# Altium schematic sheet 08.SchDoc
size 297 x 209 mm
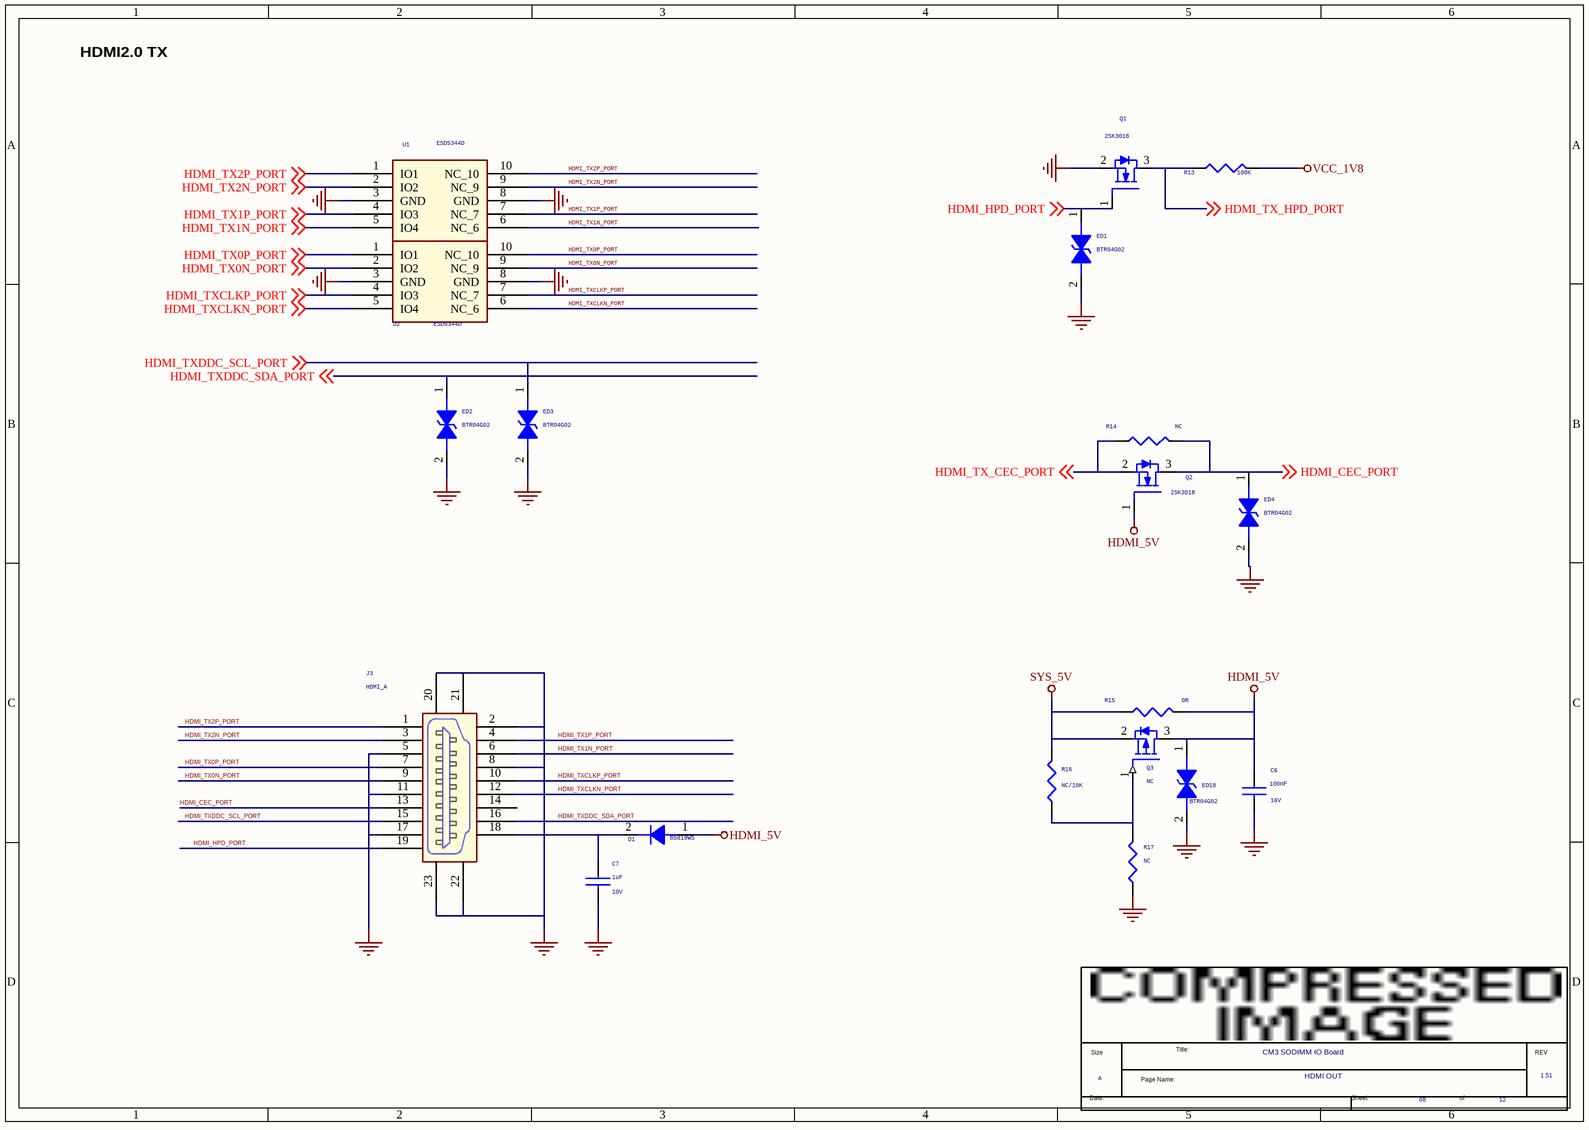
[diagram p0: 08.SchDoc]

## Parts
*  Page Count: 12  Page Number: 08  Page Size: A  Title: CM3 SODIMM IO Board  RevCode: 1.51  Doc: HDMI OUT  (hidden comment: radxa_1010)  (graphical)
C6  100nF  Voltage: 16V  [C0402]
C7  1uF  Voltage: 10V  [C0402]
D1  B5819WS  [SOD_323]
ED1  BTR04G02  [ESD0402_1xD5]
ED2  BTR04G02  [ESD0402_1xD5]
ED3  BTR04G02  [ESD0402_1xD5]
ED4  BTR04G02  [ESD0402_1xD5]
ED18  BTR04G02  [ESD0402_1xD5]
J3  HDMI_A  [HDMIA19S]
Q1  2SK3018  [SOT23]
Q2  2SK3018  [SOT23]
Q3  NC  [SOT23]
R13  100K  [R0402]
R14  NC  [R0402]
R15  0R  [R0402]
R16  NC/10K  [R0402]
R17  NC  [R0402]
U1  ESD5344D  [SON10_2R50X1R00X0R50]
U2  ESD5344D  [SON10_2R50X1R00X0R50]

## Nets
GND: C6.2 C7.2 ED1.2 ED2.2 ED3.2 ED4.2 ED18.2 J3.2 J3.5 J3.8 J3.11 J3.17 J3.20 J3.21 J3.22 J3.23 Q1.2(SOURCE) R17.1 U1.3(GND) U1.8(GND) U2.3(GND) U2.8(GND)
HDMI_5V: C6.1 D1.1(A) ED18.1 Q2.1(GATE) Q3.3(DRAIN) R15.2
SYS_5V: Q3.2(SOURCE) R15.1 R16.2
VCC_1V8: R13.2
HDMI_CEC_PORT: ED4.1 J3.13 Q2.3(DRAIN) R14.2 ; off-sheet HDMI_CEC_PORT
HDMI_HPD_PORT: ED1.1 J3.19 Q1.1(GATE) ; off-sheet HDMI_HPD_PORT
HDMI_TX0N_PORT: J3.9 U2.2(IO2) U2.9(NC_9) ; off-sheet HDMI_TX0N_PORT
HDMI_TX0P_PORT: J3.7 U2.1(IO1) U2.10(NC_10) ; off-sheet HDMI_TX0P_PORT
HDMI_TX1N_PORT: J3.6 U1.5(IO4) U1.6(NC_6) ; off-sheet HDMI_TX1N_PORT
HDMI_TX1P_PORT: J3.4 U1.4(IO3) U1.7(NC_7) ; off-sheet HDMI_TX1P_PORT
HDMI_TX2N_PORT: J3.3 U1.2(IO2) U1.9(NC_9) ; off-sheet HDMI_TX2N_PORT
HDMI_TX2P_PORT: J3.1($PIN0) U1.1(IO1) U1.10(NC_10) ; off-sheet HDMI_TX2P_PORT
HDMI_TX_CEC_PORT: Q2.2(SOURCE) R14.1 ; off-sheet HDMI_TX_CEC_PORT
HDMI_TX_HPD_PORT: Q1.3(DRAIN) R13.1 ; off-sheet HDMI_TX_HPD_PORT
HDMI_TXCLKN_PORT: J3.12 U2.5(IO4) U2.6(NC_6) ; off-sheet HDMI_TXCLKN_PORT
HDMI_TXCLKP_PORT: J3.10 U2.4(IO3) U2.7(NC_7) ; off-sheet HDMI_TXCLKP_PORT
HDMI_TXDDC_SCL_PORT: ED3.1 J3.15 ; off-sheet HDMI_TXDDC_SCL_PORT
HDMI_TXDDC_SDA_PORT: ED2.1 J3.16 ; off-sheet HDMI_TXDDC_SDA_PORT
NetC7_1: C7.1 D1.2(K) J3.18
NetQ3_1: Q3.1(GATE) R16.1 R17.2

Not connected (* = marked no-connect by the designer): J3 14

## Notes on the sheet
- HDMI2.0 TX
- (in symbol radxa_1010) Title:; Size; REV; Page Name:; Date:; Sheet; of

## Library data of the parts
C6 = CAP NP_0: cap,100.00nF,+/-10%,10V,X5R,C0201; Manufacturer PN: C0603X5R1A104K030BC; Manufacturer: TDK; Tolerance: 10%; Priority: A; Dielectric: X5R; Created by: JJJ; Part Type: C0201; RK PN: C0603X5R1A104K030BC
C7 = CAP NP_0: cap,1.00uF,+/-10%,10V,X5R,C0402; Manufacturer: TDK; RK PN: C1005X5R1A105K050BB; Priority: A; Tolerance: 10%; Dielectric: X5R; Part Type: C0402; Manufacturer PN: C1005X5R1A105K050BB; Created by: JJJ
D1 = DIODE_Dup1: Schottky Barrier，B5819WS SOD-323; Manufacturer: 长电; Priority: A; RK PN: B5819WS; Part Type: Schottky rectifier; Manufacturer PN: B5819WS; Created by: JJJ
ED1-ED4 = DIODE BI_DIR TRIG: 1-Line, Bi-directional, Transient Voltage Suppressors.17.5pF.; Manufacturer: WillSemi(韦尔半导体); RK PN: ESD5451N; Priority: A; Part Type: ESD_TVS; Manufacturer PN: ESD5451N; Created by: JJJ
ED18 = DIODE BI_DIR TRIG: 1-Line, Bi-directional, Transient Voltage Suppressors.17.5pF.; Manufacturer PN: ESD5451N; Manufacturer: WillSemi(韦尔半导体); Priority: A; Created by: JJJ; Part Type: ESD_TVS; RK PN: ESD5451N
J3 = HDMI_A: 通用A型HDMI座,卧式,侧插; Manufacturer: 旺科达; Priority: A; RK PN: HDMI_A; Part Type: HDMI Jack; Manufacturer Part Number: HDMI_A; Created by: JJJ
Q1 Q2 = MOSFET N: NMOS,2SK3018,SOT_323,Id=0.1A,Vds=30V; Manufacturer: ROHM; Rds: 5ohm; Priority: A; Id_max: 0.1A; Vgs: 20V; VDS: 30V; Vgsth: 1.5V; Pd: 0.2W; RK PN: 2SK3018; Part Type: NMOS; Manufacturer PN: 2SK3018; Created by: JJJ
Q3 = MOSFET P: PMOS,WPM2015-3/TR,SOT_23,Id=2.4A,Vds=20V; Manufacturer: WillSemi(韦尔半导体); ROOM: CHG; Priority: A; Id_max: 2.4A; Vgs: ±8V; VDS: 20V; Vgsth: 0.62V; Pd: 0.5W; option: DNP; RK PN: WPM2015-3/TR; Part Type: PMOS; Manufacturer PN: WPM2015-3/TR; Created by: JJJ
R13-R15 = RESISTOR_0: 通用厚膜电阻,0R,+/-5%,R0402,1/16W.; Manufacturer: YAGEO; Tolerance: 5%; RK PN: RC0402JR-070RL; Priority: A; Wattage: 1/16W; Part Type: 通用厚膜电阻; Manufacturer PN: RC0402JR-070RL; Created by: YTL
R16 = RESISTOR_0: 通用厚膜电阻,10K,+/-5%,R0402,1/16W.; Manufacturer PN: RC0402JR-0710KL; Manufacturer: YAGEO; Tolerance: 5%; Wattage: 1/16W; Priority: A; Created by: YTL; Part Type: 通用厚膜电阻; RK PN: RC0402JR-0710KL
R17 = RESISTOR_0_Dup3
U1 U2 = ESD_ESD5304D: 4-Lines, Uni-directional, Ultra-low Capacitance Transient Voltage Suppressors; Manufacturer: WillSemi(韦尔半导体); Priority: A; RK PN: ESD5304D; Part Type: ESD_TVS; Manufacturer PN: ESD5304D; Created by: JJJ
* = radxa_1010: Page Create Date: March  8, 1995